# Altium schematic sheet STM Schematic.SchDoc
size A; Organization: Altium Limited; Address1: L3, 12a Rodborough Rd; Address2: Frenchs Forest; Address3: NSW; Address4: Australia 2086
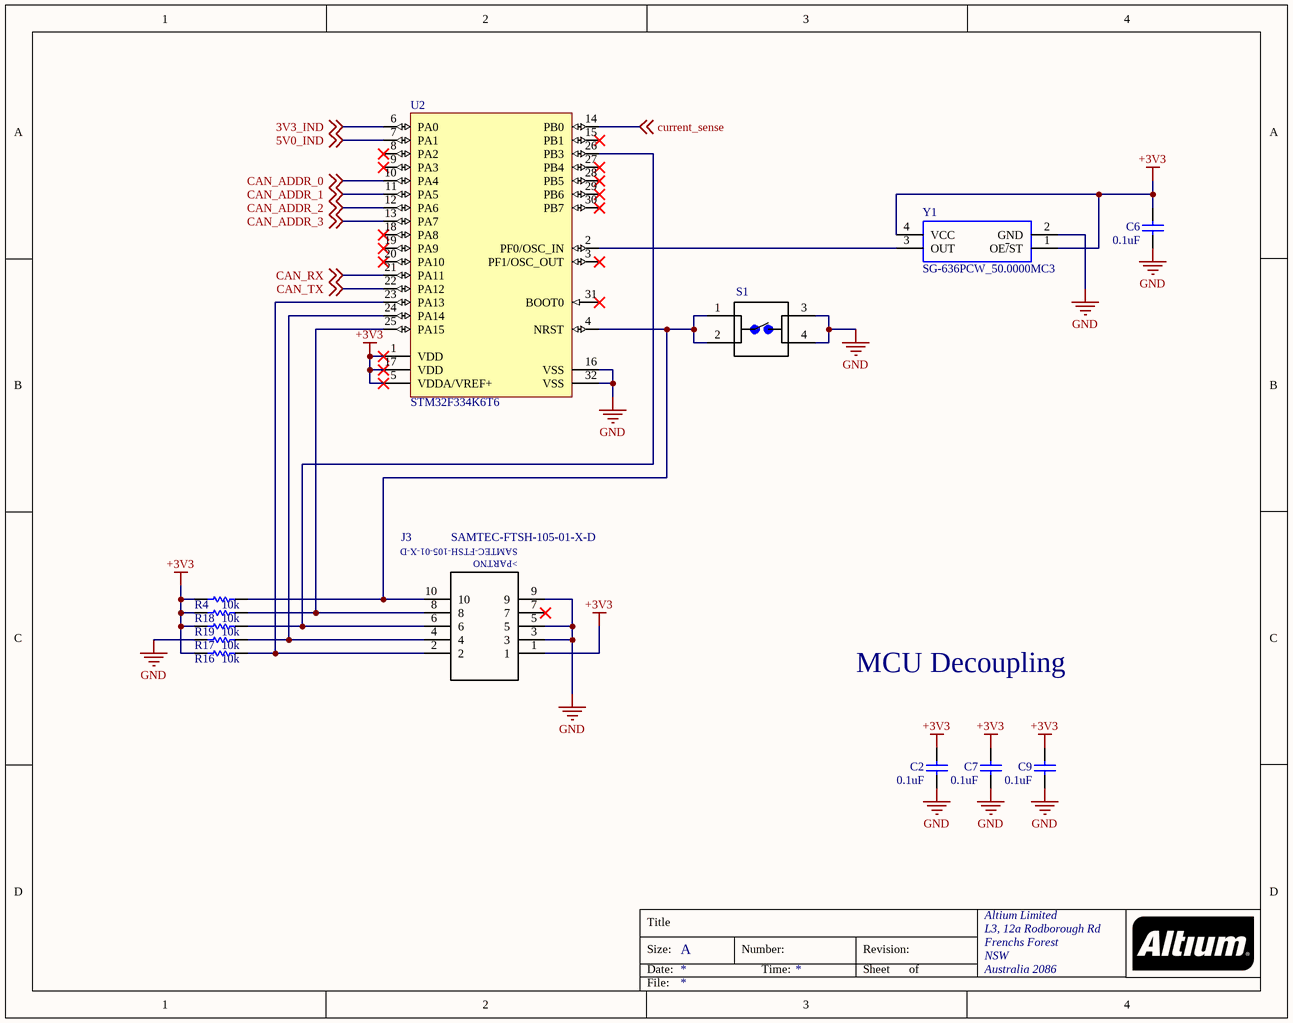
[diagram p0: STM Schematic.SchDoc]

## Parts
C2  0.1uF  [CAPC0805(2012)75_L]
C6  0.1uF  [CAPC0805(2012)75_L]
C7  0.1uF  [CAPC0805(2012)75_L]
C9  0.1uF  [CAPC0805(2012)75_L]
J3  SAMTEC-FTSH-105-01-X-D  [SAMTEC-FTSH-105-01-X-D]
R4  10k  [RESC2013X70X40LL20T20]
R16  10k  [RESC2013X70X40LL20T20]
R17  10k  [RESC2013X70X40LL20T20]
R18  10k  [RESC2013X70X40LL20T20]
R19  10k  [RESC2013X70X40LL20T20]
S1  1825910-7  [Switch 6mm 24V (NO)]  (value not drawn)
U2  STM32F334K6T6  [STM-LQFP32_N]
Y1  SG-636PCW_50.0000MC3  [SG-636]

## Nets
+3V3: C2.2 C6.2 C7.2 C9.2 J3.1 R4.1 R16.1 R18.1 R19.1 U2.1(VDD) U2.5(VDDA/VREF+) U2.17(VDD) Y1.1(OE~{/}ST) Y1.4(VCC)
GND: C2.1 C6.1 C7.1 C9.1 J3.3 J3.5 J3.9 R17.1 S1.3 S1.4 U2.16(VSS) U2.32(VSS) Y1.2(GND)
3V3_IND: U2.6(PA0) ; off-sheet 3V3_IND
5V0_IND: U2.7(PA1) ; off-sheet 5V0_IND
CAN_ADDR_0: U2.10(PA4) ; off-sheet CAN_ADDR_0
CAN_ADDR_1: U2.11(PA5) ; off-sheet CAN_ADDR_1
CAN_ADDR_2: U2.12(PA6) ; off-sheet CAN_ADDR_2
CAN_ADDR_3: U2.13(PA7) ; off-sheet CAN_ADDR_3
CAN_RX: U2.21(PA11) ; off-sheet CAN_RX
CAN_TX: U2.22(PA12) ; off-sheet CAN_TX
current_sense: U2.14(PB0) ; off-sheet current_sense
NetJ3_2: J3.2 R16.2 U2.23(PA13)
NetJ3_4: J3.4 R17.2 U2.24(PA14)
NetJ3_6: J3.6 R19.2 U2.26(PB3)
NetJ3_8: J3.8 R18.2 U2.25(PA15)
NetJ3_10: J3.10 R4.2 S1.1 S1.2 U2.4(NRST)
NetU2_2: U2.2(PF0/OSC_IN) Y1.3(OUT)

Not connected (* = marked no-connect by the designer): J3 7*; U2 3(PF1/OSC_OUT)* 8(PA2)* 9(PA3)* 15(PB1)* 18(PA8)* 19(PA9)* 20(PA10)* 27(PB4)* 28(PB5)* 29(PB6)* 30(PB7)* 31(BOOT0)*

## Notes on the sheet
- MCU Decoupling
- Title
- Size:
- Date:
- A
- Number:
- Time:
- Revision:
- Sheet
- of
- File:
- (in symbol SAMTEC-FTSH-105-01-X-D) >PARTNO

## Library data of the parts
C2 C6 C7 C9 = CMP-1036-00339-1: CAP 2.7pF 50V ±0.1pF 0805 (2012 Metric) Thickness 0.75mm SMD; Case-EIA: 0805; Case-Metric: 2012; Tolerance: Â±0.1pF; Rated Voltage: 50 V; Value: 2.7pF; Max Thickness: 0.75 mm; Technology: SMT
R4 R16-R19 = CMP-2001-04440-2: RES SMD 150K OHM 1% 1/8W 0805; Manufacturer: Panasonic; Part Number: ERJ-6ENF1503V; Datasheet: http://industrial.panasonic.com/cdbs/www-data/pdf/RDA0000/AOA0000C86.pdf
S1 = Switch 6mm 24V (NO): FSM4JAH=6MM TACT SWITCH, HIGH TEMP; MF: TE Connectivity; Contact_Current_Rating: 50 mA; Configuration_Pole-Throw: Single Pole - Single Throw; Package: None; Digi-Key_Part_Number: 450-1804-ND; Digi-Key_Purchase_URL: https://www.digikey.com/product-detail/en/te-connectivity-alcoswitch-switches/1825910-7/450-1804-ND/1731414?utm_source=snapeda&utm_medium=aggregator&utm_campaign=symbol; MP: 1825910-7; SnapEDA_Link: https://www.snapeda.com/parts/1825910-7/TE%20Connectivity%20ALCOSWITCH%20Switches/view-part/?ref=snap; EU_RoHS_Compliance: Compliant; TE_purchase_URL: https://www.te.com/usa-en/product-1825910-7.html?te_bu=Cor&te_type=disp&te_campaign=seda_glo_cor-seda-global-disp-prtnr-fy19-seda-model-bom-cta_sma-317_1&elqCampaignId=32493; Value: *
U2 = STM32F334K6T6: ARM Cortex-M4 32-bit MCU, 32-Pin LQFP, 32 KB Flash, 16 KB Internal RAM, 25 I/Os, -40 to 85 degC, Tray; D/A Converter: 3; Internal RAM Size (kB): 16; I/Os (High Current): 25; Supply Voltage(Vcc) min (V): 2; Operating Frequency(F) (Processor speed) (MHz): 72; FLASH Size (Prog) (kB): 32; ComponentLink1Description: Manufacturer URL; Mounting Technology: Surface Mount; ComponentLink1URL: http://www.st.com/; Package Description: 32-Pin Low Profile Quad Flat Package, 7 x 7 mm Body, 0.8 mm Pitch; ComponentLink2URL: http://www.st.com/st-web-ui/static/active/en/resource/technical/document/datasheet/DM00097745.pdf; Packing: Tray; Package Reference: LQFP32; Core: ARM Cortex-M4; ComponentLink2Description: Datasheet; DatasheetVersion: Rev. 4
Y1 = SG-636PCW_50.0000MC3__ROHS: Standard Clock Oscillators 50MHz 3.3Volt 100ppm -20C +70C; Manufacturer_Name: Epson Timing; Manufacturer_Part_Number: SG-636PCW 50.0000MC3: ROHS; RS Part Number: *; RS Price/Stock: *; Arrow Part Number: SG-636PCW 50.0000MC3: ROHS; Arrow Price/Stock: *; Datasheet Link: http://www.mouser.com/ds/2/137/G-636PCE_en-1003252.pdf